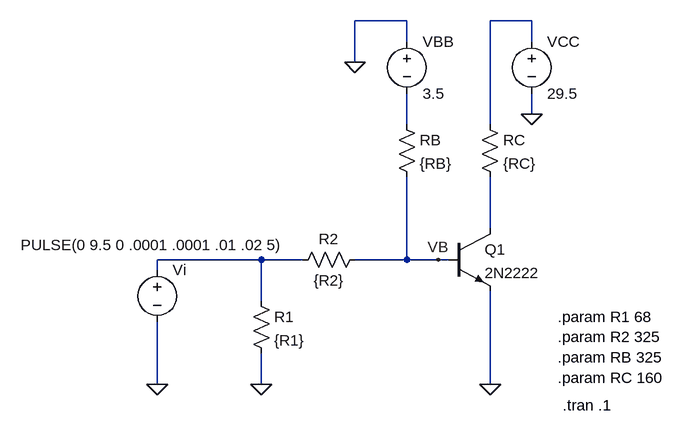
[diagram p0: schematic 2N2222Datasheet01.asc]
2N2222Datasheet01.asc, the LTspice schematic file:
Version 4.1
SHEET 1 880 680
WIRE 176 -208 96 -208
WIRE 368 -208 304 -208
WIRE 176 -176 176 -208
WIRE 368 -176 368 -208
WIRE 96 -144 96 -208
WIRE 368 -64 368 -96
WIRE 176 -48 176 -96
WIRE 304 -48 304 -208
WIRE 304 112 304 32
WIRE -48 160 -208 160
WIRE 16 160 -48 160
WIRE 176 160 176 32
WIRE 176 160 96 160
WIRE 224 160 176 160
WIRE 240 160 224 160
WIRE -208 176 -208 160
WIRE -48 224 -48 160
WIRE -208 352 -208 256
WIRE -48 352 -48 304
WIRE 304 352 304 208
FLAG -208 352 0
FLAG -48 352 0
FLAG 304 352 0
FLAG 96 -144 0
FLAG 368 -64 0
FLAG 224 160 VB
SYMBOL npn 240 112 R0
SYMATTR InstName Q1
SYMATTR Value 2N2222
SYMBOL res -64 208 R0
SYMATTR InstName R1
SYMATTR Value {R1}
SYMBOL res 288 -64 R0
SYMATTR InstName RC
SYMATTR Value {RC}
SYMBOL res 160 -64 R0
SYMATTR InstName RB
SYMATTR Value {RB}
SYMBOL res 112 144 R90
WINDOW 0 0 56 VBottom 2
WINDOW 3 32 56 VTop 2
SYMATTR InstName R2
SYMATTR Value {R2}
SYMBOL voltage -208 160 R0
WINDOW 123 0 0 Left 0
WINDOW 39 0 0 Left 0
WINDOW 3 -210 -23 Left 2
SYMATTR Value PULSE(0 9.5 0 .0001 .0001 .01 .02 5)
SYMATTR InstName Vi
SYMBOL voltage 176 -192 R0
SYMATTR InstName VBB
SYMATTR Value 3.5
SYMBOL voltage 368 -192 R0
SYMATTR InstName VCC
SYMATTR Value 29.5
TEXT 408 248 Left 2 !.param R1 68\n.param R2 325\n.param RB 325\n.param RC 160
TEXT 416 384 Left 2 !.tran .1

The netlist it stands for:
* 2N2222Datasheet01.asc
Q1 N003 VB 0 0 2N2222
R1 N004 0 {R1}
RC N001 N003 {RC}
RB N002 VB {RB}
R2 VB N004 {R2}
Vi N004 0 PULSE(0 9.5 0 .0001 .0001 .01 .02 5)
VBB 0 N002 3.5
VCC N001 0 29.5
.model NPN NPN
.model PNP PNP
.lib standard.bjt
.param R1 68
.param R2 325
.param RB 325
.param RC 160
.tran .1
.backanno
.end